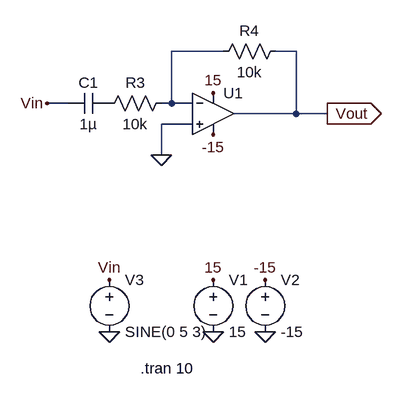
[diagram p0: schematic 1-4-2.asc]
1-4-2.asc, the LTspice schematic file:
Version 4
SHEET 1 880 680
WIRE 160 -32 80 -32
WIRE 272 -32 240 -32
WIRE -80 48 -112 48
WIRE 80 48 80 -32
WIRE 80 48 64 48
WIRE 112 48 80 48
WIRE 272 64 272 -32
WIRE 272 64 176 64
WIRE 320 64 272 64
WIRE 112 80 64 80
WIRE 64 128 64 80
FLAG 144 400 0
FLAG 224 400 0
FLAG 144 320 15
FLAG 224 320 -15
FLAG 144 96 -15
FLAG 144 32 15
FLAG -112 48 Vin
FLAG 320 64 Vout
IOPIN 320 64 Out
FLAG -16 320 Vin
FLAG -16 400 0
FLAG 64 128 0
SYMBOL OpAmps\\UniversalOpAmp2 144 64 R0
SYMATTR InstName U1
SYMBOL voltage 144 304 R0
SYMATTR InstName V1
SYMATTR Value 15
SYMBOL voltage 224 304 R0
SYMATTR InstName V2
SYMATTR Value -15
SYMBOL voltage -16 304 R0
WINDOW 123 24 124 Left 2
WINDOW 39 0 0 Left 0
SYMATTR InstName V3
SYMATTR Value SINE(0 5 3)
SYMBOL cap -16 32 R90
WINDOW 0 0 32 VBottom 2
WINDOW 3 32 32 VTop 2
SYMATTR InstName C1
SYMATTR Value 1µ
SYMBOL res 80 32 R90
WINDOW 0 0 56 VBottom 2
WINDOW 3 32 56 VTop 2
SYMATTR InstName R3
SYMATTR Value 10k
SYMBOL res 256 -48 R90
WINDOW 0 0 56 VBottom 2
WINDOW 3 32 56 VTop 2
SYMATTR InstName R4
SYMATTR Value 10k
TEXT 32 456 Left 2 !.tran 10

The netlist it stands for:
* 1-4-2.asc
XU1 0 N001 15 -15 Vout level2 Avol=1Meg GBW=10Meg Slew=10Meg Ilimit=25m Rail=0 Vos=0 En=0 Enk=0 In=0 Ink=0 Rin=500Meg  ; pins In+ In- V+ V- OUT
V1 15 0 15
V2 -15 0 -15
V3 Vin 0 SINE(0 5 3)
C1 P001 Vin 1µ
R3 N001 P001 10k
R4 Vout N001 10k
.tran 10
.lib UniversalOpAmp2.lib
.backanno
.end

* Results of the author's LTspice run, read from the files saved beside the schematic
* Operating Point, zero values left out:
*   V(15) = 15 V
*   V(-15) = -15 V
*   I(V1) = -1.498 mA
*   I(V2) = 1.498 mA
*   Ix(u1:3) = 1.498 mA
*   Ix(u1:4) = -1.498 mA
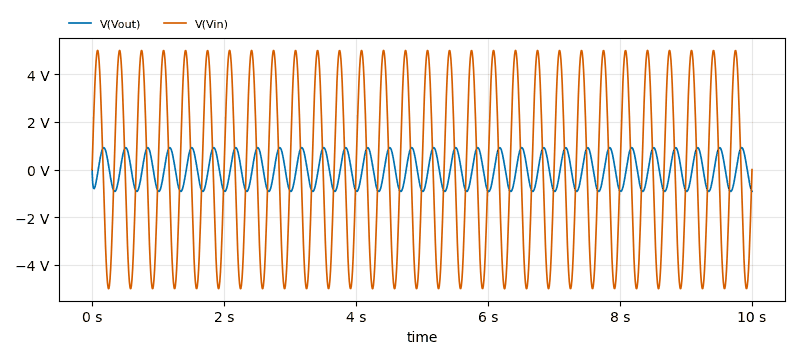
[diagram p1: Transient Analysis of 1-4-2.asc, plotted from the saved traces]
* Transient Analysis, 1 run:
*   V(Vout): min -920.9 mV, max 920.8 mV, average 943.5 µV, rms 650 mV, last -911.8 mV
*   V(Vin): min -5 V, max 5 V, average 9.086 µV, rms 3.537 V, last 0 V